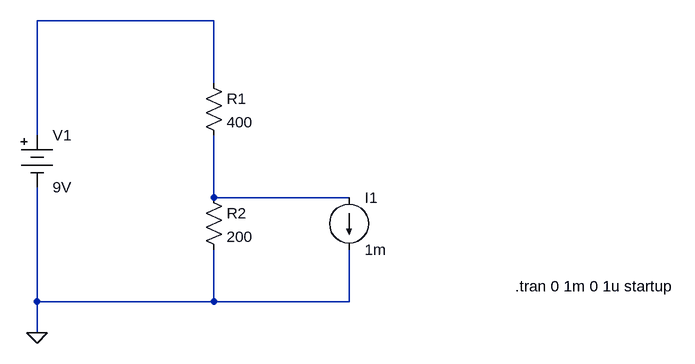
[diagram p0: schematic Circut Design Principals.asc]
Circut Design Principals.asc, the LTspice schematic file:
Version 4
SHEET 1 976 680
WIRE 240 96 -32 96
WIRE 240 192 240 96
WIRE -32 272 -32 96
WIRE 240 368 240 272
WIRE 448 368 240 368
WIRE -32 528 -32 352
WIRE 240 528 240 448
WIRE 240 528 -32 528
WIRE 448 528 448 448
WIRE 448 528 240 528
WIRE -32 576 -32 528
FLAG -32 576 0
SYMBOL Misc/battery -32 256 R0
SYMATTR InstName V1
SYMATTR Value 9V
SYMBOL res 224 176 R0
SYMATTR InstName R1
SYMATTR Value 400
SYMBOL res 224 352 R0
SYMATTR InstName R2
SYMATTR Value 200
SYMBOL current 448 368 R0
SYMATTR InstName I1
SYMATTR Value 1m
TEXT 704 504 Left 2 !.tran 0 1m 0 1u startup

The netlist it stands for:
* Circut Design Principals.asc
V1 N001 0 9V
R1 N001 N002 400
R2 N002 0 200
I1 N002 0 1m
.tran 0 1m 0 1u startup
.backanno
.end